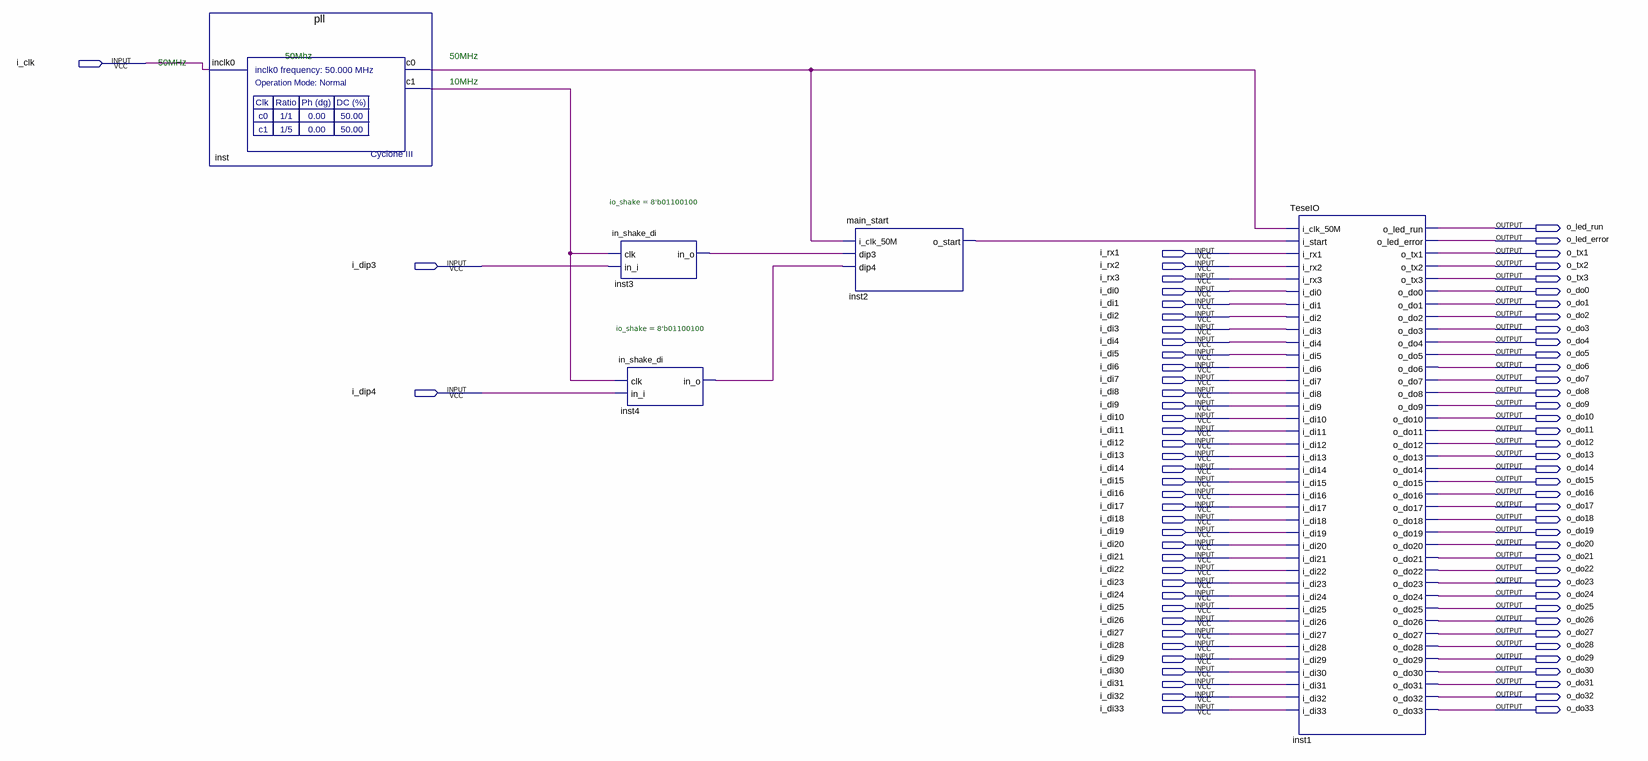
[diagram p0: schematic sheet]
// Quartus schematic COM_4U.bdf as structural Verilog: 5 symbols, 79 pins
module COM_4U (
  input  i_clk,
  input  i_rx1,
  input  i_dip3,
  input  i_rx2,
  input  i_rx3,
  input  i_di0,
  input  i_di1,
  input  i_di2,
  input  i_di3,
  input  i_di4,
  input  i_di5,
  input  i_di6,
  input  i_di7,
  input  i_dip4,
  input  i_di8,
  input  i_di9,
  input  i_di10,
  input  i_di11,
  input  i_di12,
  input  i_di13,
  input  i_di14,
  input  i_di15,
  input  i_di16,
  input  i_di17,
  input  i_di18,
  input  i_di19,
  input  i_di20,
  input  i_di21,
  input  i_di22,
  input  i_di23,
  input  i_di24,
  input  i_di25,
  input  i_di26,
  input  i_di27,
  input  i_di28,
  input  i_di29,
  input  i_di30,
  input  i_di31,
  input  i_di32,
  input  i_di33,
  output o_led_run,
  output o_led_error,
  output o_tx1,
  output o_tx2,
  output o_tx3,
  output o_do0,
  output o_do1,
  output o_do2,
  output o_do3,
  output o_do4,
  output o_do5,
  output o_do6,
  output o_do7,
  output o_do8,
  output o_do9,
  output o_do10,
  output o_do11,
  output o_do12,
  output o_do13,
  output o_do14,
  output o_do15,
  output o_do16,
  output o_do17,
  output o_do18,
  output o_do19,
  output o_do20,
  output o_do21,
  output o_do22,
  output o_do23,
  output o_do24,
  output o_do25,
  output o_do26,
  output o_do27,
  output o_do28,
  output o_do29,
  output o_do30,
  output o_do31,
  output o_do32,
  output o_do33
);

  wire inst2_o_start, inst3_in_o, inst4_in_o, inst_c0, inst_c1;

  pll inst (.inclk0(i_clk), .c0(inst_c0), .c1(inst_c1));
  in_shake_di #(.io_shake(8'b01100100)) inst3 (.clk(inst_c1), .in_i(i_dip3), .in_o(inst3_in_o));
  in_shake_di #(.io_shake(8'b01100100)) inst4 (.clk(inst_c1), .in_i(i_dip4), .in_o(inst4_in_o));
  main_start inst2 (.i_clk_50M(inst_c0), .dip3(inst3_in_o), .dip4(inst4_in_o), .o_start(inst2_o_start));
  TeseIO inst1 (
    .i_clk_50M(inst_c0), .i_start(inst2_o_start), .i_rx1(i_rx1), .i_rx2(i_rx2), .i_rx3(i_rx3), .i_di0(i_di0),
    .i_di1(i_di1), .i_di2(i_di2), .i_di3(i_di3), .i_di4(i_di4), .i_di5(i_di5), .i_di6(i_di6), .i_di7(i_di7),
    .i_di8(i_di8), .i_di9(i_di9), .i_di10(i_di10), .i_di11(i_di11), .i_di12(i_di12), .i_di13(i_di13),
    .i_di14(i_di14), .i_di15(i_di15), .i_di16(i_di16), .i_di17(i_di17), .i_di18(i_di18), .i_di19(i_di19),
    .i_di20(i_di20), .i_di21(i_di21), .i_di22(i_di22), .i_di23(i_di23), .i_di24(i_di24), .i_di25(i_di25),
    .i_di26(i_di26), .i_di27(i_di27), .i_di28(i_di28), .i_di29(i_di29), .i_di30(i_di30), .i_di31(i_di31),
    .i_di32(i_di32), .i_di33(i_di33), .o_led_run(o_led_run), .o_led_error(o_led_error), .o_tx1(o_tx1),
    .o_tx2(o_tx2), .o_tx3(o_tx3), .o_do0(o_do0), .o_do1(o_do1), .o_do2(o_do2), .o_do3(o_do3), .o_do4(o_do4),
    .o_do5(o_do5), .o_do6(o_do6), .o_do7(o_do7), .o_do8(o_do8), .o_do9(o_do9), .o_do10(o_do10),
    .o_do11(o_do11), .o_do12(o_do12), .o_do13(o_do13), .o_do14(o_do14), .o_do15(o_do15), .o_do16(o_do16),
    .o_do17(o_do17), .o_do18(o_do18), .o_do19(o_do19), .o_do20(o_do20), .o_do21(o_do21), .o_do22(o_do22),
    .o_do23(o_do23), .o_do24(o_do24), .o_do25(o_do25), .o_do26(o_do26), .o_do27(o_do27), .o_do28(o_do28),
    .o_do29(o_do29), .o_do30(o_do30), .o_do31(o_do31), .o_do32(o_do32), .o_do33(o_do33));

  // Notes on the sheet:
  //   50Mhz
  //   50MHz
  //   50MHz
  //   10MHz
endmodule
